# EAGLE design awc_v2 (EAGLE 8.4.2)
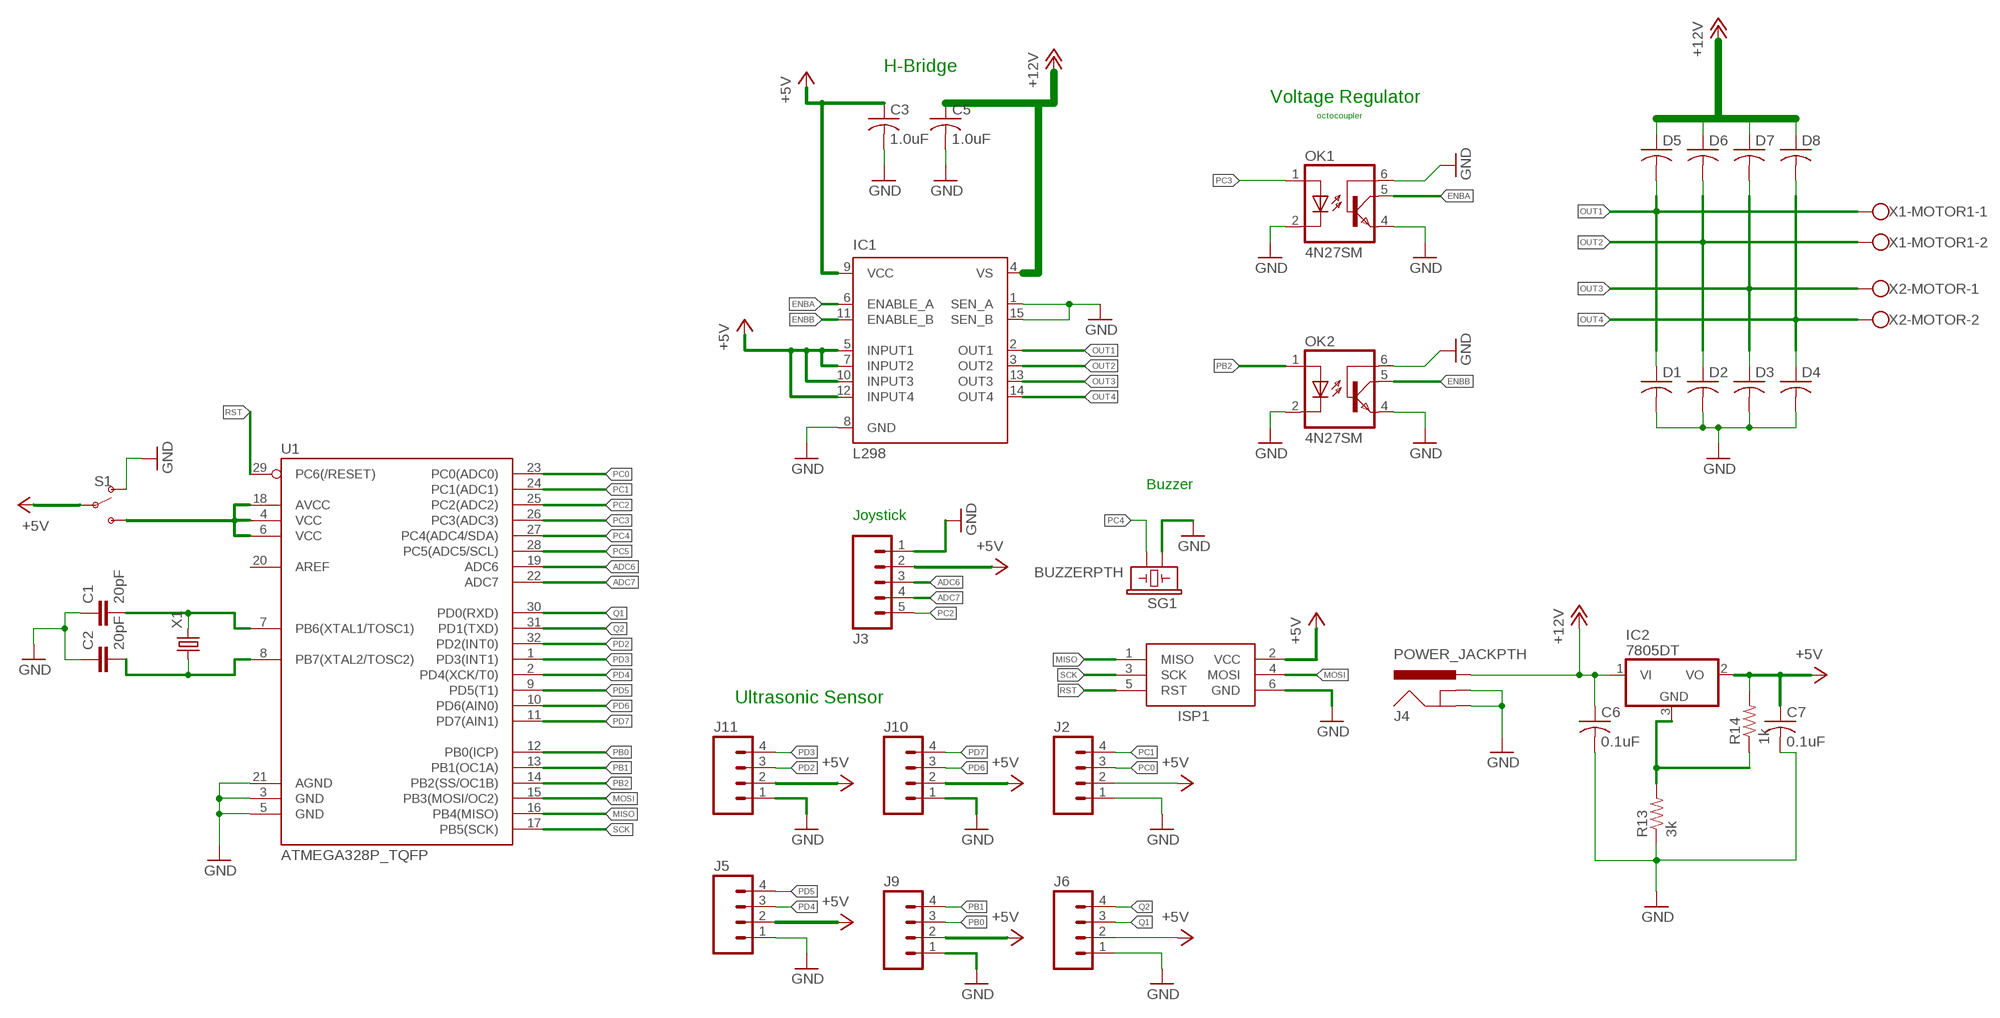
[diagram p0: schematic, sheet 1]

## Parts
C1  20pF  C-EUC0805  [C0805]
C2  20pF  C-EUC0805  [C0805]
C3  1.0uF  C-USC0805  [C0805]
C5  1.0uF  C-USC0805  [C0805]
C6  0.1uF  C-USC0805  [C0805]
C7  0.1uF  C-USC0805  [C0805]
D1  C-USC0805  [C0805]
D2  C-USC0805  [C0805]
D3  C-USC0805  [C0805]
D4  C-USC0805  [C0805]
D5  C-USC0805  [C0805]
D6  C-USC0805  [C0805]
D7  C-USC0805  [C0805]
D8  C-USC0805  [C0805]
IC1  L298  [MULTIWATT-15]
IC2  7805DT  [TO252]
ISP1  AVRISP-6  [AVRISP]
J2  M04SCREW_LOCK  [SCREWTERMINAL-3.5MM-4_LOCK]
J3  M05SCREW  [SCREWTERMINAL-3.5MM-5]
J4  POWER_JACKPTH  [POWER_JACK_PTH]
J5  M04SCREW_LOCK  [SCREWTERMINAL-3.5MM-4_LOCK]
J6  M04SCREW_LOCK  [SCREWTERMINAL-3.5MM-4_LOCK]
J9  M04SCREW_LOCK  [SCREWTERMINAL-3.5MM-4_LOCK]
J10  M04SCREW_LOCK  [SCREWTERMINAL-3.5MM-4_LOCK]
J11  M04SCREW_LOCK  [SCREWTERMINAL-3.5MM-4_LOCK]
OK1  4N27SM  [DIL6-SMD]
OK2  4N27SM  [DIL6-SMD]
R13  3k  RESISTOR0402  [0402-RES]
R14  1k  R-US_M0805  [M0805]
S1  SWITCH-SPDT-PTH-11.6X4.0MM  [SWITCH_SPDT_PTH_11.6X4.0MM]
SG1  BUZZERPTH  [BUZZER-12MM]
U1  ATMEGA328P_TQFP  [TQFP32-08]
X1  CRYSTALHC49UP  [HC49UP]
X1-MOTOR1  W237-102  [W237-102]
X2-MOTOR  W237-102  [W237-102]

## Nets
+5V: C3.1 C7.1 IC1.5(INPUT1) IC1.7(INPUT2) IC1.9(VCC) IC1.10(INPUT3) IC1.12(INPUT4) IC2.2(VO) ISP1.2(VCC) J2.2 J3.2 J5.2 J6.2 J9.2 J10.2 J11.2 R14.2 S1.2(P)
+12V: C5.1 C6.1 D5.1 D6.1 D7.1 D8.1 IC1.4(VS) IC2.1(VI) J4.PWR
ADC6: J3.3 U1.19(ADC6)
ADC7: J3.4 U1.22(ADC7)
ENBA: IC1.6(ENABLE_A) OK1.5(COL)
ENBB: IC1.11(ENABLE_B) OK2.5(COL)
GND: C1.1 C2.1 C3.2 C5.2 C6.2 C7.2 D1.2 D2.2 D3.2 D4.2 IC1.1(SEN_A) IC1.8(GND) IC1.15(SEN_B) ISP1.6(GND) J2.1 J3.1 J4.GND J4.GNDBREAK J5.1 J6.1 J9.1 J10.1 J11.1 OK1.2(C) OK1.4(EMI) OK1.6(BAS) OK2.2(C) OK2.4(EMI) OK2.6(BAS) R13.1 S1.1(O) SG1.+ U1.3(GND) U1.5(GND) U1.21(AGND)
MISO: ISP1.1(MISO) U1.16(PB4(MISO))
MOSI: ISP1.4(MOSI) U1.15(PB3(MOSI/OC2))
N$5: C1.2 U1.7(PB6(XTAL1/TOSC1)) X1.2
N$6: C2.2 U1.8(PB7(XTAL2/TOSC2)) X1.1
N$7: IC2.3(GND) R13.2 R14.1
N$8: S1.3(S) U1.4(VCC) U1.6(VCC) U1.18(AVCC)
OUT1: D1.1 D5.2 IC1.2(OUT1) X1-MOTOR1.1
OUT2: D2.1 D6.2 IC1.3(OUT2) X1-MOTOR1.2
OUT3: D3.1 D7.2 IC1.13(OUT3) X2-MOTOR.1
OUT4: D4.1 D8.2 IC1.14(OUT4) X2-MOTOR.2
PB0: J9.3 U1.12(PB0(ICP))
PB1: J9.4 U1.13(PB1(OC1A))
PB2: OK2.1(A) U1.14(PB2(SS/OC1B))
PC0: J2.3 U1.23(PC0(ADC0))
PC1: J2.4 U1.24(PC1(ADC1))
PC2: J3.5 U1.25(PC2(ADC2))
PC3: OK1.1(A) U1.26(PC3(ADC3))
PC4: SG1.- U1.27(PC4(ADC4/SDA))
PC5: U1.28(PC5(ADC5/SCL))
PD2: J11.3 U1.32(PD2(INT0))
PD3: J11.4 U1.1(PD3(INT1))
PD4: J5.3 U1.2(PD4(XCK/T0))
PD5: J5.4 U1.9(PD5(T1))
PD6: J10.3 U1.10(PD6(AIN0))
PD7: J10.4 U1.11(PD7(AIN1))
Q1: J6.3 U1.30(PD0(RXD))
Q2: J6.4 U1.31(PD1(TXD))
RST: ISP1.5(RST) U1.29(PC6(/RESET))
SCK: ISP1.3(SCK) U1.17(PB5(SCK))
Unconnected: U1.20(AREF)

## Notes on the sheet
- H-Bridge
- Voltage Regulator
- octocoupler
- Buzzer
- Joystick
- Ultrasonic Sensor

## Library data of the parts
C1 C2 = resistor:C-EU: CAPACITOR, European symbol
C3 C5-C7 D1-D8 = adafruit:C-US: CAPACITOR, American symbol
IC1 = st-microelectronics:L298: DUAL FULL-BRIDGE DRIVER; MPN: L298N; OC_FARNELL: 1589425; OC_NEWARK: 32M1527
IC2 = ece388:78*: Positive VOLTAGE REGULATOR Added bigger pads to the TO-92 package
ISP1 = adafruit:AVRISP: AVR ISP HEADER Standard 6 pin header for AVR programming
J2 J5 J6 J9-J11 = SparkFun-Connectors:M04: Header 4 Standard 4-pin 0.1" header. Use with straight break away headers (SKU : PRT-00116), right angle break away headers (PRT-00553), swiss pins (PRT-00743), machine pins (PRT-00117), and female headers (PRT-00115). Molex polarized connector foot print use with SKU : PRT-08231 with associated crimp pins and housings. 1MM SMD Version SKU: PRT-10208
J3 = SparkFun-Connectors:M05: Header 5 Standard 5-pin 0.1" header. Use with straight break away headers (SKU : PRT-00116), right angle break away headers (PRT-00553), swiss pins (PRT-00743), machine pins (PRT-00117), and female headers (PRT-00115). Molex polarized connector foot print use with SKU : PRT-08230 with associated crimp pins and housings.; PROD_ID: Combine 8288+8399
J4 = SparkFun-Connectors:POWER_JACK: Power Jack This is the standard 5.5mm barrel jack for power. The PTH is the most common, proven, reliable, footprint. The Slot footprint only works if the mill layer is transmitted to the PCB fab house so be warned. Mating wall wart : TOL-00298 (and others); PROD_ID: CONN-08197
OK1 OK2 = optocoupler:4N*?M: General Purpose 6-Pin Phototransistor Optocouplers Source: http://www.fairchildsemi.com/ds/4N/4N35-M.pdf; MF: FAIRCHILD SEMICONDUCTOR; MPN: 4N27S-M; OC_FARNELL: unknown; OC_NEWARK: 05C3300
R13 = SparkFun-Resistors:RESISTOR: Resistor Basic schematic elements and footprints for 0603, 1206, and PTH resistors.
R14 = adafruit:R-US_: RESISTOR, American symbol
S1 = SparkFun-Switches:SWITCH-SPDT: Single Pole, Double Throw (SPDT) Switch Single-pole, double-throw (SPDT) switch. Variant Overview SMD-AYZ0202 Surface Mount DPDT Switch <https://www.sparkfun.com/products/597> (COM-00597) Used on e.g. LilyPad Arduino USB - ATmega32U4 Board <https://www.sparkfun.com/products/12049> PTH-11.6X4.0MM SPDT Mini Power Switch <https://www.sparkfun.com/products/102> (COM-00102) Used on e.g. SparkFun Simon Says - Through-Hole Soldering Kit <https://www.sparkfun.com/products/10547> (KIT-10547) PTH-11.6X4.0MM-KIT KIT version of SPDT Mini Power Switch - Simplifies soldering by removing tStop of switch pins - only one side can be soldered. PTH-11.6X4.0MM-LOCK LOCK version of SPDT Mini Power Switch - Offset pins hold switch in place for easier soldering. SMD-RIGHT-ANGLE Surface Mount Right Angle Switch <https://www.sparkfun.com/products/10860> (COM-10860) Used on e.g. SparkFun ESP8266 Thing <https://www.sparkfun.com/products/13231>; PROD_ID: SWCH-08261; SF_SKU: COM-00102
SG1 = SparkFun-Electromechanical:BUZZER: Buzzer 12mm Spark Fun Electronics SKU : Comp-Buzzer
U1 = SparkFun-DigitalIC:ATMEGA328P_TQFP; PROD_ID: IC-09069
X1 = adafruit:CRYSTAL: CRYSTAL; OC_FARNELL: unknown; OC_NEWARK: unknown
X1-MOTOR1 X2-MOTOR = con-wago-500:W237-102: WAGO SCREW CLAMP; MPN: 237-102; OC_FARNELL: unknown; OC_NEWARK: 70K9898

## Board
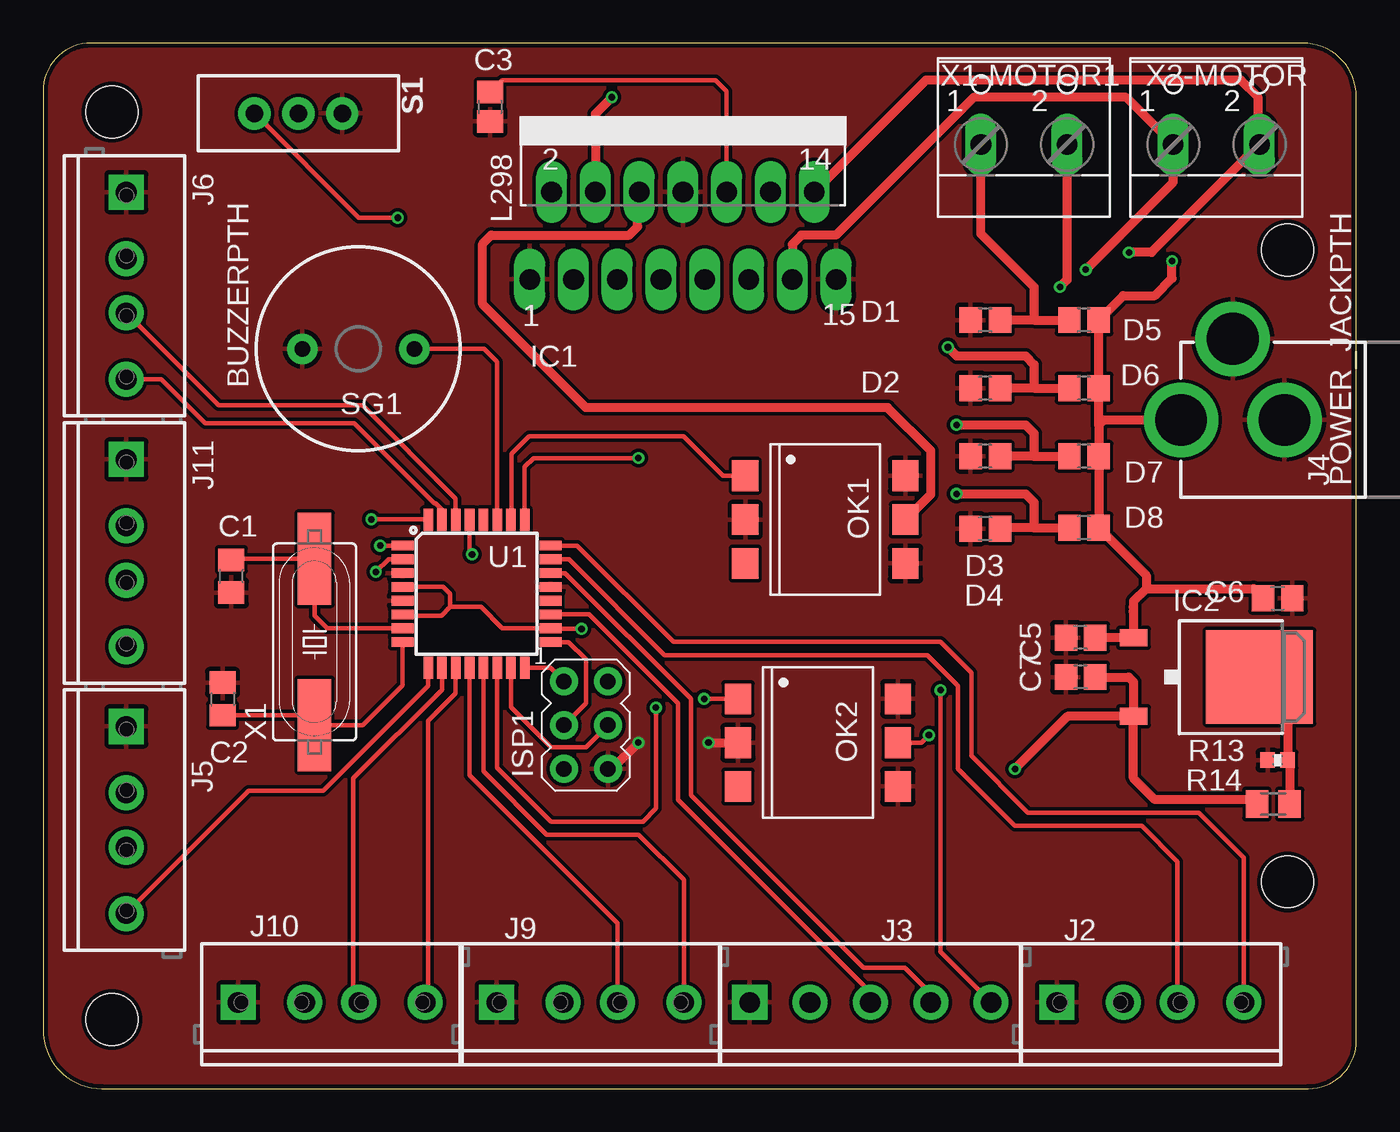
[diagram p1: board, top side]
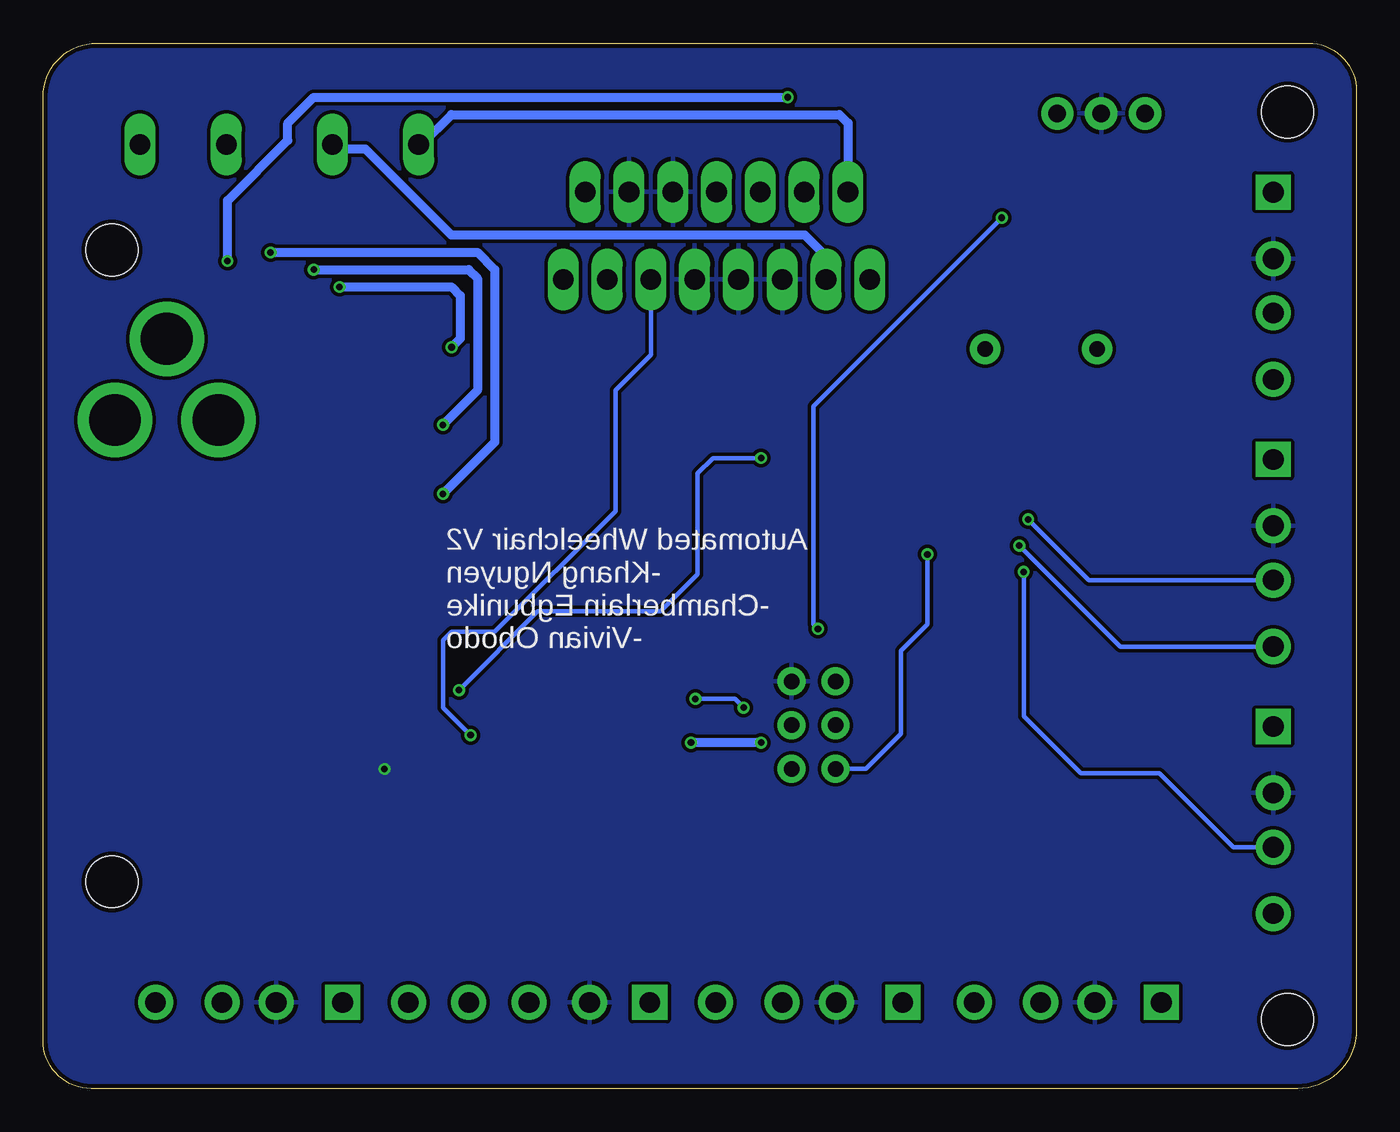
[diagram p2: board, bottom side, seen from below]

Size 76.2 x 60.64 mm. Coordinates in mm from the lower left corner, seen from the top.
Outline: 76.2,2.79 76.2,57.54 arc90 73.09,60.64 2.77,60.64 arc90 0,57.87 0,3.41 arc90 3.41,0 73.41,0 arc90 76.2,2.79
Copper layers (1*16): Top 0.035mm / dielectric 1.5mm / Bottom 0.035mm
Design rules "Dirty8TS": minimum track width 8mil, minimum drill 15mil, track to track 8mil, track to pad 8mil, pad to pad 8mil, via to via 8mil, smd to smd 0mil, copper to edge 10mil, drill to drill 10mil, minimum pad ring 10mil, minimum via ring 6mil, stop-mask expansion 2mil, vias tented up to drill 25mil, thermal gap 10mil
Holes 3 mm at 4,56.64 4,4 72.2,12 72.2,48.64

### Footprints (pad centres in the part's own frame; a part is rotated, then mirrored left to right if it is on the bottom)
C0805 = smd 1.3 x 1.5: 1 -0.95,0; 2 0.95,0
C0805' = smd 1.3 x 1.5: 1 -0.85,0; 2 0.85,0
MULTIWATT-15 = drill 1.2 long: 1 -8.89,-7.62; 2 -7.62,-2.54; 3 -6.35,-7.62; 4 -5.08,-2.54; 5 -3.81,-7.62; 6 -2.54,-2.54; 7 -1.27,-7.62; 8 0,-2.54; 9 1.27,-7.62; 10 2.54,-2.54; 11 3.81,-7.62; 12 5.08,-2.54; 13 6.35,-7.62; 14 7.62,-2.54; 15 8.89,-7.62
TO252 = smd 1 x 1.6: 1 -2.28,-4.8; 2 2.28,-4.8 | smd 5.4 x 6.2: 3 0,2.5
AVRISP = drill 0.9 pad 1.626: 1 -1.27,2.54; 2 1.27,2.54; 3 -1.27,0; 4 1.27,0; 5 -1.27,-2.54; 6 1.27,-2.54
SCREWTERMINAL-3.5MM-4_LOCK = drill 1.2 pad 2.032 square: 1 -0.178,0 | drill 1.2 pad 2.032: 2 3.678,0; 3 6.822,0; 4 10.678,0
SCREWTERMINAL-3.5MM-5 = drill 1.2 pad 2.032 square: 1 0,0 | drill 1.2 pad 2.032: 2 3.5,0; 3 7,0; 4 10.5,0; 5 14,0
POWER_JACK_PTH = drill 2.997 pad 4.318: GND 0,7.7; GNDBREAK 4.7,10.7; PWR 0,13.7
DIL6-SMD = smd 1.78 x 1.52: 1 -2.54,-4.645; 2 0,-4.645; 3 2.54,-4.645; 4 2.54,4.645; 5 0,4.645; 6 -2.54,4.645
0402-RES = smd 0.85 x 0.9: 1 -0.58,0; 2 0.58,0
M0805 = smd 1.3 x 1.6: 1 -0.95,0; 2 0.95,0
SWITCH_SPDT_PTH_11.6X4.0MM = drill 1.016 pad 1.88: 1 0,2.54; 2 0,0; 3 0,-2.54
BUZZER-12MM = drill 0.9 pad 1.778: + 3.25,0; - -3.25,0
TQFP32-08 = smd 1.27 x 0.559: 1 -4.293,2.8; 2 -4.293,2; 3 -4.293,1.2; 4 -4.293,0.4; 5 -4.293,-0.4; 6 -4.293,-1.2; 7 -4.293,-2; 8 -4.293,-2.8; 17 4.293,-2.8; 18 4.293,-2; 19 4.293,-1.2; 20 4.293,-0.4; 21 4.293,0.4; 22 4.293,1.2; 23 4.293,2; 24 4.293,2.8 | smd 0.559 x 1.27: 9 -2.8,-4.293; 10 -2,-4.293; 11 -1.2,-4.293; 12 -0.4,-4.293; 13 0.4,-4.293; 14 1.2,-4.293; 15 2,-4.293; 16 2.8,-4.293; 25 2.8,4.293; 26 2,4.293; 27 1.2,4.293; 28 0.4,4.293; 29 -0.4,4.293; 30 -1.2,4.293; 31 -2,4.293; 32 -2.8,4.293
HC49UP = smd 5.334 x 1.93: 1 -4.826,0; 2 4.826,0
W237-102 = drill 1.194 long: 1 -2.5,-1.27; 2 2.5,-1.27

### Placement (x,y rotation side)
C1  10.92,29.72 90 top
C2  10.41,22.61 270 top
C3  1.0uF  [C0805']  25.94,56.95 270 top
C5  1.0uF  [C0805']  60.2,26.16 180 top
C6  0.1uF  [C0805']  71.63,28.45 0 top
C7  0.1uF  [C0805']  60.2,23.88 180 top
D1  [C0805']  54.67,44.58 180 top
D2  [C0805']  54.67,40.63 180 top
D3  [C0805']  54.67,36.68 180 top
D4  [C0805']  54.67,32.47 180 top
D5  [C0805']  60.4,44.58 180 top
D6  [C0805']  60.4,40.63 180 top
D7  [C0805']  60.4,36.68 180 top
D8  [C0805']  60.4,32.53 180 top
IC1  37.12,54.55 0 top
IC2  68.07,23.88 270 top
ISP1  31.5,21.08 0 top
J2  59,5 0 top
J3  41,5 0 top
J4  79.72,38.79 90 top
J5  4.83,20.83 270 top
J6  4.83,51.82 270 top
J9  26.5,5 0 top
J10  11.5,5 0 top
J11  4.83,36.32 270 top
OK1  45.39,33 270 top
OK2  44.96,20.07 270 top
R13  71.63,19.05 0 top
R14  71.37,16.51 180 top
S1  14.81,56.56 270 top
SG1  18.29,42.91 180 top
U1  25.15,28.7 0 top
X1  15.75,25.91 90 top
X1-MOTOR1  56.91,56.04 0 top
X2-MOTOR  68.07,56.04 0 top

### Tracks (layer width: path | path; a pad name or v marks a point on that pad's centre or on a via)
+5V  (via drill 0.38)
  Top 0.254: C3.1 26.64,58.5 39,58.5 39.66,57.84 IC1.10
  Top 0.508: IC2.2 59.44,21.59 v56.39,18.54 | R14.2 70.17,16.76 64.52,16.76 63.27,18.01 IC2.2 | C7.1 62.99,23.88 63.27,23.6 IC2.2
  pour Bottom: 81.03,65.53 -4.06,65.79 -1.52,-3.3 81.28,-3.81
+12V  (via drill 0.38)
  Top 0.508: 63.27,27.66 IC2.1 C5.1 | 63.27,27.66 63.25,27.69 63.25,27.94 | 61.25,38.5 D7.1 D8.1 64,29.77 64,29 | 61.25,38.5 D6.1 D5.1 62.66,46 64.5,46 65.5,47 v65.5,48 | C6.1 70.23,29 64,29 | 64,29 63.27,28.27 63.27,27.66 | J4.PWR 61.54,38.79 61.25,38.5 | v33,57.5 32.04,56.54 IC1.4
  Bottom 0.508: v65.5,48 65.5,51.5 62,55 62,56 60.5,57.5 v33,57.5
ADC6
  Top 0.254: U1.19 31.68,27.5 36.83,22.35 36.83,16.76 48,5.59 J3.3
ADC7
  Top 0.254: 39.8,14.8 37.59,17.02 37.59,22.61 30.3,29.9 U1.22 | 39.8,14.8 40.13,14.48 | 39.8,14.8 47.61,7 50,7 51.5,5.5 J3.4
ENBA
  Top 0.254: OK1.5
  Top 0.508: OK1.5 51.5,34.47 51.5,37 49,39.5 31.5,39.5 25.5,45.5 25.5,49 26,49.5 34,49.5 34.5,50 34.5,51.93 IC1.6
ENBB  (via drill 0.38)
  Top 0.254: OK2.5 50.96,20.07 v51.4,20.5
  Bottom 0.254: 51.5,20.5 v51.4,20.5 53,22.1 53,26 52.5,26.5 50,26.5 43,33.5 43,40.5 40.93,42.57 IC1.11
GND  (via drill 0.38)
  Top 0.508: ISP1.6 33.02,18.54 v34.54,20.07 | v38.61,20.07 OK2.2
  Bottom 0.508: v34.54,20.07 v38.61,20.07
  pour Top: -1.52,64.26 -5.33,-3.56 79.76,-3.81 78.49,62.74
MISO
  Top 0.254: ISP1.1 29.44,24.41 U1.16
MOSI
  Top 0.254: ISP1.4 31.5,19.81 29.46,19.81 27.15,22.13 U1.15
N$5
  Top 0.254: U1.7 16.48,26.7 15.75,27.43 X1.2 10.99,30.73 C1.2
N$6
  Top 0.254: U1.8 20.85,23.39 18.54,21.08 16,21.08 | 16,21.08 X1.1 | C2.2 15.43,21.66 16,21.08
N$7
  Top 0.508: IC2.3 72.21,22.24 R13.2 72.32,18.93 R14.1
N$8  (via drill 0.38)
  Top 0.254: U1.6 20.92,27.43 23.11,27.43 23.62,27.94 | 23.62,27.94 23.62,28.7 23.22,29.1 U1.4 | 23.62,27.94 25.4,27.94 26.64,26.7 U1.18 29.47,26.67 v31.24,26.67 | S1.3 18.32,50.51 v20.57,50.51
  Bottom 0.254: v31.24,26.67 31.5,26.92 31.5,39.59 v20.57,50.51
OUT1
  Top 0.508: 57.5,44.58 D1.1 | 57.5,44.58 D5.2 | X1-MOTOR1.1 54.41,49.59 57.5,46.5 57.5,44.58
  Bottom 0.508: X1-MOTOR1.1 54.23,54.77 52.5,56.5 30,56.5 29.5,56 IC1.2
OUT2  (via drill 0.38)
  Top 0.508: 57.5,40.63 D2.1 | 57.5,40.63 D6.2 | X1-MOTOR1.2 59.41,46.91 v59,46.5 | v52.5,43 53,42.5 57,42.5 57.5,42 57.5,40.63
  Bottom 0.508: v59,46.5 52.5,46.5 52,46 52,43.5 v52.5,43 | IC1.3 30.77,48.27 32,49.5 52.5,49.5 57.5,54.5 59.14,54.5 X1-MOTOR1.2
OUT3  (via drill 0.38)
  Top 0.508: 57.5,36.68 D3.1 | 57.5,36.68 D7.2 | v60.5,47.5 65.57,52.57 X2-MOTOR.1 62.84,57.5 54,57.5 46,49.5 44,49.5 43.47,48.97 IC1.13 | v53,38.5 57,38.5 57.5,38 57.5,36.68
  Bottom 0.508: v60.5,47.5 51.5,47.5 51,47 51,40.5 v53,38.5
OUT4  (via drill 0.38)
  Top 0.508: D4.1 55.57,32.53 57.5,32.53 | 57.5,32.53 D8.2 | v63,48.5 64.3,48.5 X2-MOTOR.2 70.57,55.43 70.5,55.5 70.5,57.5 69.5,58.5 51.23,58.5 IC1.14 | v53,34.5 57,34.5 57.5,34 57.5,32.53
  Bottom 0.508: v63,48.5 51,48.5 50,47.5 50,37.5 v53,34.5
PB0
  Top 0.254: U1.12 24.75,18.18 33.32,9.6 J9.3
PB1
  Top 0.254: U1.13 25.55,18.4 29.21,14.73 34.55,14.73 37.18,12.11 J9.4
PB2  (via drill 0.38)
  Top 0.254: U1.14 26.35,18.61 29.46,15.49 34.8,15.49 35.56,16.26 v35.56,22.1 | v38.35,22.61 OK2.1
  Bottom 0.254: v35.56,22.1 36.07,22.61 v38.35,22.61
PC0
  Top 0.254: U1.23 30.51,30.7 36.07,25.15 51.31,25.15 53.09,23.37 53.09,18.54 56.39,15.24 63.75,15.24 65.82,13.17 J2.3
PC1
  Top 0.254: U1.24 30.98,31.5 36.58,25.91 52.07,25.91 53.85,24.13 53.85,19.3 57.15,16 67.06,16 69.68,13.38 J2.4
PC2  (via drill 0.38)
  Top 0.254: U1.25 27.95,36.07 28.45,36.58 v34.54,36.58 | v52.07,23.11 52.07,16 | 52.07,16 52.07,15.52 | 52.07,16 52.07,7.93 J3.5
  Bottom 0.254: v34.54,36.58 37.34,36.58 38.23,35.69 38.23,29.84 40.39,27.69 47.5,27.69 v52.07,23.11
PC3
  Top 0.254: U1.26 27.18,33.03 27.18,36.83 28.19,37.85 37.15,37.85 39.46,35.54 OK1.1
PC4
  Top 0.254: U1.27 26.35,40.5 | 26.35,40.5 26.35,40.66 | 26.35,40.5 26.35,42.15 25.59,42.91 SG1.-
PD2  (via drill 0.38)
  Top 0.254: U1.32 22.32,33.02 v19.05,33.02
  Bottom 0.254: v19.05,33.02 15.53,29.5 J11.3
PD3  (via drill 0.38)
  Top 0.254: U1.1 v19.56,31.5
  Bottom 0.254: v19.56,31.5 13.71,25.64 J11.4
PD4  (via drill 0.38)
  Top 0.254: U1.2 20.03,30.7 v19.3,29.97
  Bottom 0.254: v19.3,29.97 19.3,21.59 16,18.29 11.43,18.29 7.15,14.01 J5.3
PD5
  Top 0.254: U1.9 22.35,23.36 16.26,17.27 11.94,17.27 J5.4
PD6
  Top 0.254: U1.10 23.15,23.15 18,18 18,5.32 J10.3
PD7
  Top 0.254: U1.11 23.95,22.93 22.35,21.34 22.35,5.17 J10.4
Q1
  Top 0.254: J6.3 10.2,39.62 18.54,39.62 23.95,34.22 U1.30
Q2
  Top 0.254: J6.4 6.86,41.15 9.4,38.61 18.03,38.61 22.68,33.96 22.76,33.96 23.15,33.58 U1.31
RST  (via drill 0.38)
  Top 0.254: U1.29 24.75,31.13 v24.89,30.99
  Bottom 0.254: v24.89,30.99 24.89,26.92 26.42,25.4 26.42,20.57 28.45,18.54 ISP1.5
SCK
  Top 0.254: ISP1.3 31.5,22.35 31.5,24.89 30.49,25.9 U1.17

### Text on the board
bPlace: Automated Wheelchair V2 / -Khang Nguyen / -Chamberlain Egbunike / -Vivian Obodo